# Altium schematic sheet modFOC-Powerstage.SchDoc: modFOC-Powerstage
size A4; Author: Mathias Giller; CompanyName: HTL St. Pölten; Address1: modFOC; DocumentNumber: 3; Revision: 1.0; SheetNumber: 4; SheetTotal: 5
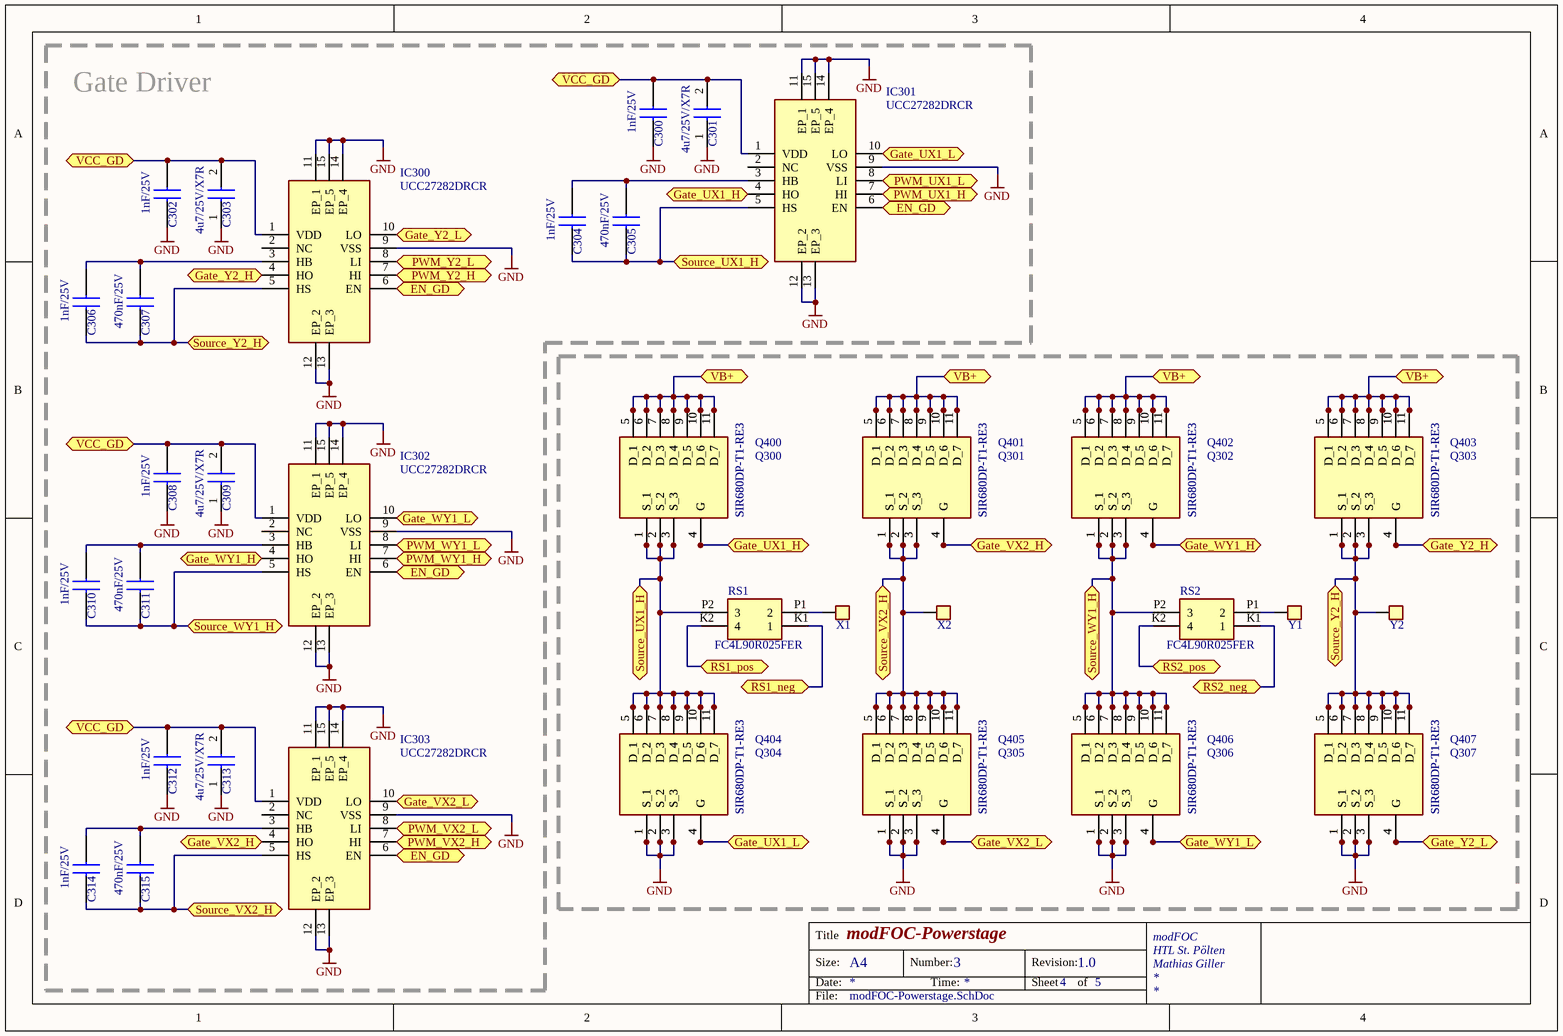
[diagram p0: modFOC-Powerstage.SchDoc]

## Parts
C300  1nF/25V  [CAPC1608X97N]
C301  4u7/25V/X7R  [CAPC2012X140N]
C302  1nF/25V  [CAPC1608X97N]
C303  4u7/25V/X7R  [CAPC2012X140N]
C304  1nF/25V  [CAPC1608X97N]
C305  470nF/25V  [CAPC1608X87N]
C306  1nF/25V  [CAPC1608X97N]
C307  470nF/25V  [CAPC1608X87N]
C308  1nF/25V  [CAPC1608X97N]
C309  4u7/25V/X7R  [CAPC2012X140N]
C310  1nF/25V  [CAPC1608X97N]
C311  470nF/25V  [CAPC1608X87N]
C312  1nF/25V  [CAPC1608X97N]
C313  4u7/25V/X7R  [CAPC2012X140N]
C314  1nF/25V  [CAPC1608X97N]
C315  470nF/25V  [CAPC1608X87N]
IC300  UCC27282DRCR  [UCC27282DRCR]
IC301  UCC27282DRCR  [UCC27282DRCR]
IC302  UCC27282DRCR  [UCC27282DRCR]
IC303  UCC27282DRCR  [UCC27282DRCR]
Q300  SIR680DP-T1-RE3  [SI7141DPT1GE3]
Q301  SIR680DP-T1-RE3  [SI7141DPT1GE3]
Q302  SIR680DP-T1-RE3  [SI7141DPT1GE3]
Q303  SIR680DP-T1-RE3  [SI7141DPT1GE3]
Q304  SIR680DP-T1-RE3  [SI7141DPT1GE3]
Q305  SIR680DP-T1-RE3  [SI7141DPT1GE3]
Q306  SIR680DP-T1-RE3  [SI7141DPT1GE3]
Q307  SIR680DP-T1-RE3  [SI7141DPT1GE3]
Q400  SIR680DP-T1-RE3  [SI7141DPT1GE3]
Q401  SIR680DP-T1-RE3  [SI7141DPT1GE3]
Q402  SIR680DP-T1-RE3  [SI7141DPT1GE3]
Q403  SIR680DP-T1-RE3  [SI7141DPT1GE3]
Q404  SIR680DP-T1-RE3  [SI7141DPT1GE3]
Q405  SIR680DP-T1-RE3  [SI7141DPT1GE3]
Q406  SIR680DP-T1-RE3  [SI7141DPT1GE3]
Q407  SIR680DP-T1-RE3  [SI7141DPT1GE3]
RS1  FC4L90R025FER  [FC4L90R025FER]
RS2  FC4L90R025FER  [FC4L90R025FER]
X1  PowerPad  [POWER_PAD]  (value not drawn)
X2  PowerPad  [POWER_PAD]  (value not drawn)
Y1  PowerPad  [POWER_PAD]  (value not drawn)
Y2  PowerPad  [POWER_PAD]  (value not drawn)

## Blocks framed on the sheet
Gate Driver: C300-C315 IC300-IC303

## Ports
EN_GD (bidir), Gate_UX1_H (bidir), Gate_UX1_L (bidir), Gate_VX2_H (bidir), Gate_VX2_L (bidir), Gate_WY1_H (bidir), Gate_WY1_L (bidir), Gate_Y2_H (bidir), Gate_Y2_L (bidir), PWM_UX1_H (bidir), PWM_UX1_L (bidir), PWM_VX2_H (bidir), PWM_VX2_L (bidir), PWM_WY1_H (bidir), PWM_WY1_L (bidir), PWM_Y2_H (bidir), PWM_Y2_L (bidir), RS1_neg (bidir), RS1_pos (bidir), RS2_neg (bidir), RS2_pos (bidir), Source_UX1_H (bidir), Source_VX2_H (bidir), Source_WY1_H (bidir), Source_Y2_H (bidir), VB+ (bidir), VCC_GD (bidir)

## Nets
GND: C300.1 C301.1 C302.1 C303.1 C308.1 C309.1 C312.1 C313.1 IC300.9(VSS) IC300.11(EP_1) IC300.12(EP_2) IC300.13(EP_3) IC300.14(EP_4) IC300.15(EP_5) IC301.9(VSS) IC301.11(EP_1) IC301.12(EP_2) IC301.13(EP_3) IC301.14(EP_4) IC301.15(EP_5) IC302.9(VSS) IC302.11(EP_1) IC302.12(EP_2) IC302.13(EP_3) IC302.14(EP_4) IC302.15(EP_5) IC303.9(VSS) IC303.11(EP_1) IC303.12(EP_2) IC303.13(EP_3) IC303.14(EP_4) IC303.15(EP_5) Q304.1(S_1) Q304.2(S_2) Q304.3(S_3) Q305.1(S_1) Q305.2(S_2) Q305.3(S_3) Q306.1(S_1) Q306.2(S_2) Q306.3(S_3) Q307.1(S_1) Q307.2(S_2) Q307.3(S_3) Q404.1(S_1) Q404.2(S_2) Q404.3(S_3) Q405.1(S_1) Q405.2(S_2) Q405.3(S_3) Q406.1(S_1) Q406.2(S_2) Q406.3(S_3) Q407.1(S_1) Q407.2(S_2) Q407.3(S_3)
EN_GD: IC300.6(EN) IC301.6(EN) IC302.6(EN) IC303.6(EN) ; port EN_GD
Gate_UX1_H: IC301.4(HO) Q300.4(G) Q400.4(G) ; port Gate_UX1_H
Gate_UX1_L: IC301.10(LO) Q304.4(G) Q404.4(G) ; port Gate_UX1_L
Gate_VX2_H: IC303.4(HO) Q301.4(G) Q401.4(G) ; port Gate_VX2_H
Gate_VX2_L: IC303.10(LO) Q305.4(G) Q405.4(G) ; port Gate_VX2_L
Gate_WY1_H: IC302.4(HO) Q302.4(G) Q402.4(G) ; port Gate_WY1_H
Gate_WY1_L: IC302.10(LO) Q306.4(G) Q406.4(G) ; port Gate_WY1_L
Gate_Y2_H: IC300.4(HO) Q303.4(G) Q403.4(G) ; port Gate_Y2_H
Gate_Y2_L: IC300.10(LO) Q307.4(G) Q407.4(G) ; port Gate_Y2_L
PWM_UX1_H: IC301.7(HI) ; port PWM_UX1_H
PWM_UX1_L: IC301.8(LI) ; port PWM_UX1_L
PWM_VX2_H: IC303.7(HI) ; port PWM_VX2_H
PWM_VX2_L: IC303.8(LI) ; port PWM_VX2_L
PWM_WY1_H: IC302.7(HI) ; port PWM_WY1_H
PWM_WY1_L: IC302.8(LI) ; port PWM_WY1_L
PWM_Y2_H: IC300.7(HI) ; port PWM_Y2_H
PWM_Y2_L: IC300.8(LI) ; port PWM_Y2_L
RS1_neg: RS1.K1(1) ; port RS1_neg
RS1_pos: RS1.K2(4) ; port RS1_pos
RS2_neg: RS2.K1(1) ; port RS2_neg
RS2_pos: RS2.K2(4) ; port RS2_pos
Source_UX1_H: C304.1 C305.1 IC301.5(HS) Q300.1(S_1) Q300.2(S_2) Q300.3(S_3) Q304.5(D_1) Q304.6(D_2) Q304.7(D_3) Q304.8(D_4) Q304.9(D_5) Q304.10(D_6) Q304.11(D_7) Q400.1(S_1) Q400.2(S_2) Q400.3(S_3) Q404.5(D_1) Q404.6(D_2) Q404.7(D_3) Q404.8(D_4) Q404.9(D_5) Q404.10(D_6) Q404.11(D_7) RS1.P2(3) ; port Source_UX1_H
Source_VX2_H: C314.1 C315.1 IC303.5(HS) Q301.1(S_1) Q301.2(S_2) Q301.3(S_3) Q305.5(D_1) Q305.6(D_2) Q305.7(D_3) Q305.8(D_4) Q305.9(D_5) Q305.10(D_6) Q305.11(D_7) Q401.1(S_1) Q401.2(S_2) Q401.3(S_3) Q405.5(D_1) Q405.6(D_2) Q405.7(D_3) Q405.8(D_4) Q405.9(D_5) Q405.10(D_6) Q405.11(D_7) X2.1 ; port Source_VX2_H
Source_WY1_H: C310.1 C311.1 IC302.5(HS) Q302.1(S_1) Q302.2(S_2) Q302.3(S_3) Q306.5(D_1) Q306.6(D_2) Q306.7(D_3) Q306.8(D_4) Q306.9(D_5) Q306.10(D_6) Q306.11(D_7) Q402.1(S_1) Q402.2(S_2) Q402.3(S_3) Q406.5(D_1) Q406.6(D_2) Q406.7(D_3) Q406.8(D_4) Q406.9(D_5) Q406.10(D_6) Q406.11(D_7) RS2.P2(3) ; port Source_WY1_H
Source_Y2_H: C306.1 C307.1 IC300.5(HS) Q303.1(S_1) Q303.2(S_2) Q303.3(S_3) Q307.5(D_1) Q307.6(D_2) Q307.7(D_3) Q307.8(D_4) Q307.9(D_5) Q307.10(D_6) Q307.11(D_7) Q403.1(S_1) Q403.2(S_2) Q403.3(S_3) Q407.5(D_1) Q407.6(D_2) Q407.7(D_3) Q407.8(D_4) Q407.9(D_5) Q407.10(D_6) Q407.11(D_7) Y2.1 ; port Source_Y2_H
VB+: Q300.5(D_1) Q300.6(D_2) Q300.7(D_3) Q300.8(D_4) Q300.9(D_5) Q300.10(D_6) Q300.11(D_7) Q301.5(D_1) Q301.6(D_2) Q301.7(D_3) Q301.8(D_4) Q301.9(D_5) Q301.10(D_6) Q301.11(D_7) Q302.5(D_1) Q302.6(D_2) Q302.7(D_3) Q302.8(D_4) Q302.9(D_5) Q302.10(D_6) Q302.11(D_7) Q303.5(D_1) Q303.6(D_2) Q303.7(D_3) Q303.8(D_4) Q303.9(D_5) Q303.10(D_6) Q303.11(D_7) Q400.5(D_1) Q400.6(D_2) Q400.7(D_3) Q400.8(D_4) Q400.9(D_5) Q400.10(D_6) Q400.11(D_7) Q401.5(D_1) Q401.6(D_2) Q401.7(D_3) Q401.8(D_4) Q401.9(D_5) Q401.10(D_6) Q401.11(D_7) Q402.5(D_1) Q402.6(D_2) Q402.7(D_3) Q402.8(D_4) Q402.9(D_5) Q402.10(D_6) Q402.11(D_7) Q403.5(D_1) Q403.6(D_2) Q403.7(D_3) Q403.8(D_4) Q403.9(D_5) Q403.10(D_6) Q403.11(D_7) ; port VB+
VCC_GD: C300.2 C301.2 C302.2 C303.2 C308.2 C309.2 C312.2 C313.2 IC300.1(VDD) IC301.1(VDD) IC302.1(VDD) IC303.1(VDD) ; port VCC_GD
NetC304_2: C304.2 C305.2 IC301.3(HB)
NetC306_2: C306.2 C307.2 IC300.3(HB)
NetC310_2: C310.2 C311.2 IC302.3(HB)
NetC314_2: C314.2 C315.2 IC303.3(HB)
NetRS1_P1: RS1.P1(2) X1.1
NetRS2_P1: RS2.P1(2) Y1.1

Not connected (* = marked no-connect by the designer): IC300 2(NC); IC301 2(NC); IC302 2(NC); IC303 2(NC)

## Notes on the sheet
- Title
- Size:
- Date:
- A4
- Number:
- Time:
- Revision:
- Sheet
- of
- File:

## Library data of the parts
C300 C302 C304 C306 C308 C310 C312 C314 = GRM033R71E102KA01D: Capacitor; Manufacturer_Name: Murata Electronics; Datasheet Link: https://psearch.en.murata.com/capacitor/product/GRM033R71E102KA01%23.html; Height: 0.33mm; Manufacturer_Part_Number: GRM033R71E102KA01D; Mouser Part Number: 81-GRM033R71E102KA1D; Mouser Price/Stock: https://www.mouser.co.uk/ProductDetail/Murata-Electronics/GRM033R71E102KA01D/?qs=%252BwCMEOx2S5vqymn%2Fc34U1A%3D%3D; Arrow Part Number: GRM033R71E102KA01D; Arrow Price/Stock: https://www.arrow.com/en/products/grm033r71e102ka01d/murata-manufacturing
C301 C303 C309 C313 = C0805C475K3RACTU: Capacitor; Manufacturer_Name: Kemet; Datasheet Link: https://componentsearchengine.com/Datasheets/1/C0805C475K3RACTU.pdf; Height: 1.4mm; Manufacturer_Part_Number: C0805C475K3RACTU; Mouser Part Number: 80-C0805C475K3RACTU; Mouser Price/Stock: https://www.mouser.co.uk/ProductDetail/KEMET/C0805C475K3RACTU?qs=PzGy0jfpSMsRb1o8vMQxfQ%3D%3D; Arrow Part Number: C0805C475K3RACTU; Arrow Price/Stock: https://www.arrow.com/en/products/c0805c475k3ractu/kemet-corporation?region=nac
C305 C307 C311 C315 = 470nF/25V: Capacitor; Manufacturer_Name: Wurth Elektronik; Manufacturer_Part_Number: 885012206075; Datasheet Link: https://katalog.we-online.com/pbs/datasheet/885012206075.pdf; Height: 0.87mm; Mouser Part Number: 710-885012206075; Mouser Price/Stock: https://www.mouser.co.uk/ProductDetail/Wurth-Elektronik/885012206075?qs=0KOYDY2FL2%252Bex%252BAYqJM6Ug%3D%3D
IC300-IC303 = UCC27282DRCR: Integrated Circuit; Manufacturer_Name: Texas Instruments; Datasheet Link: https://www.ti.com/lit/ds/symlink/ucc27282.pdf?ts=1615361050656&ref_url=https%253A%252F%252Fwww.ti.com%252Fstore%252Fti%252Fen%252Fp%252Fproduct%252F%253Fp%253DUCC27282DRCR; Height: 1mm; Manufacturer_Part_Number: UCC27282DRCR; Mouser Part Number: 595-UCC27282DRCR; Mouser Price/Stock: https://www.mouser.co.uk/ProductDetail/Texas-Instruments/UCC27282DRCR?qs=PqoDHHvF64%252BEqc2WJXKXkQ%3D%3D; Arrow Part Number: UCC27282DRCR; Arrow Price/Stock: https://www.arrow.com/en/products/ucc27282drcr/texas-instruments?region=nac
Q300-Q307 Q400-Q407 = SIR680DP-T1-RE3: MOSFET (N-Channel); Manufacturer_Name: Vishay; Datasheet Link: https://www.vishay.com/docs/75267/sir680dp.pdf; Height: 1.12mm; Manufacturer_Part_Number: SIR680DP-T1-RE3; Mouser Part Number: 78-SIR680DP-T1-RE3; Mouser Price/Stock: https://www.mouser.co.uk/ProductDetail/Vishay-Siliconix/SIR680DP-T1-RE3?qs=Mv7BduZupUi1ZFscSbHz5g%3D%3D; Arrow Part Number: SIR680DP-T1-RE3; Arrow Price/Stock: https://www.arrow.com/en/products/sir680dp-t1-re3/vishay
RS1 RS2 = FC4L90R025FER: Resistor; Manufacturer_Name: Ohmite; Datasheet Link: https://componentsearchengine.com/Datasheets/1/FC4L90R025FER.pdf; Height: 0.8mm; Manufacturer_Part_Number: FC4L90R025FER; Mouser Part Number: 588-FC4L90R025FER; Mouser Price/Stock: https://www.mouser.co.uk/ProductDetail/Ohmite/FC4L90R025FER?qs=lc2O%252BfHJPVauiFLZwCqH8Q%3D%3D